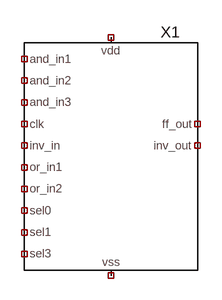
[diagram p0: schematic Test_std_cell_top.asc]
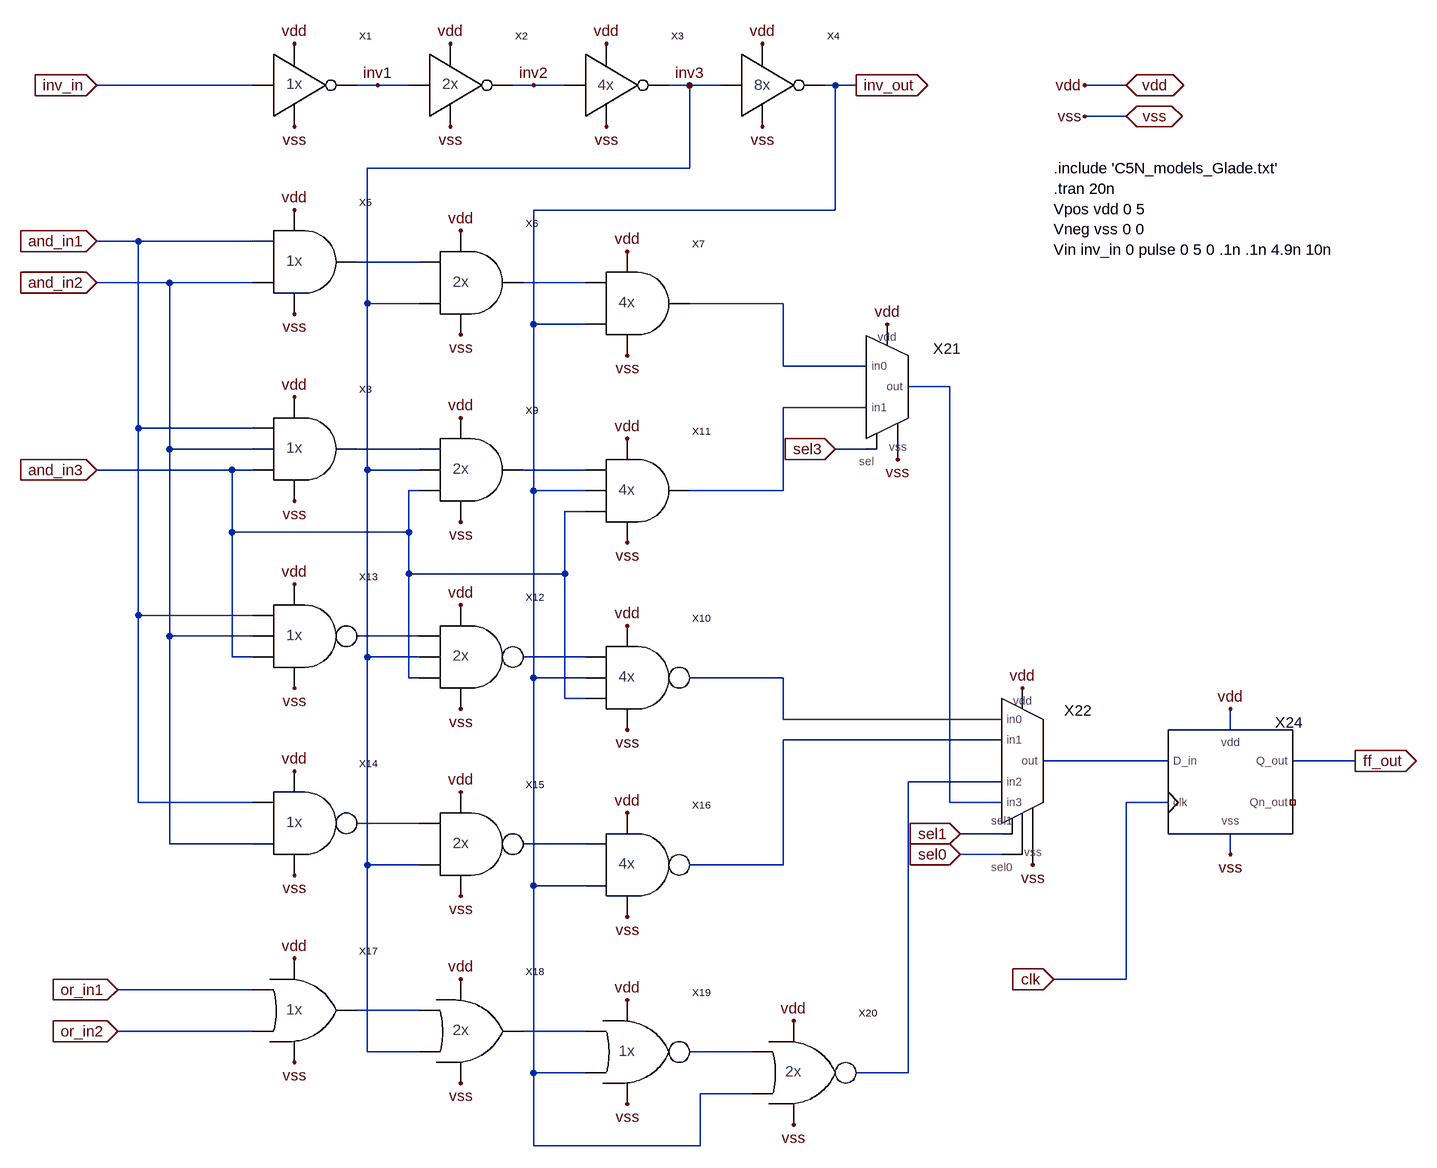
[diagram p1: sub-circuit test_std_cell.asc]
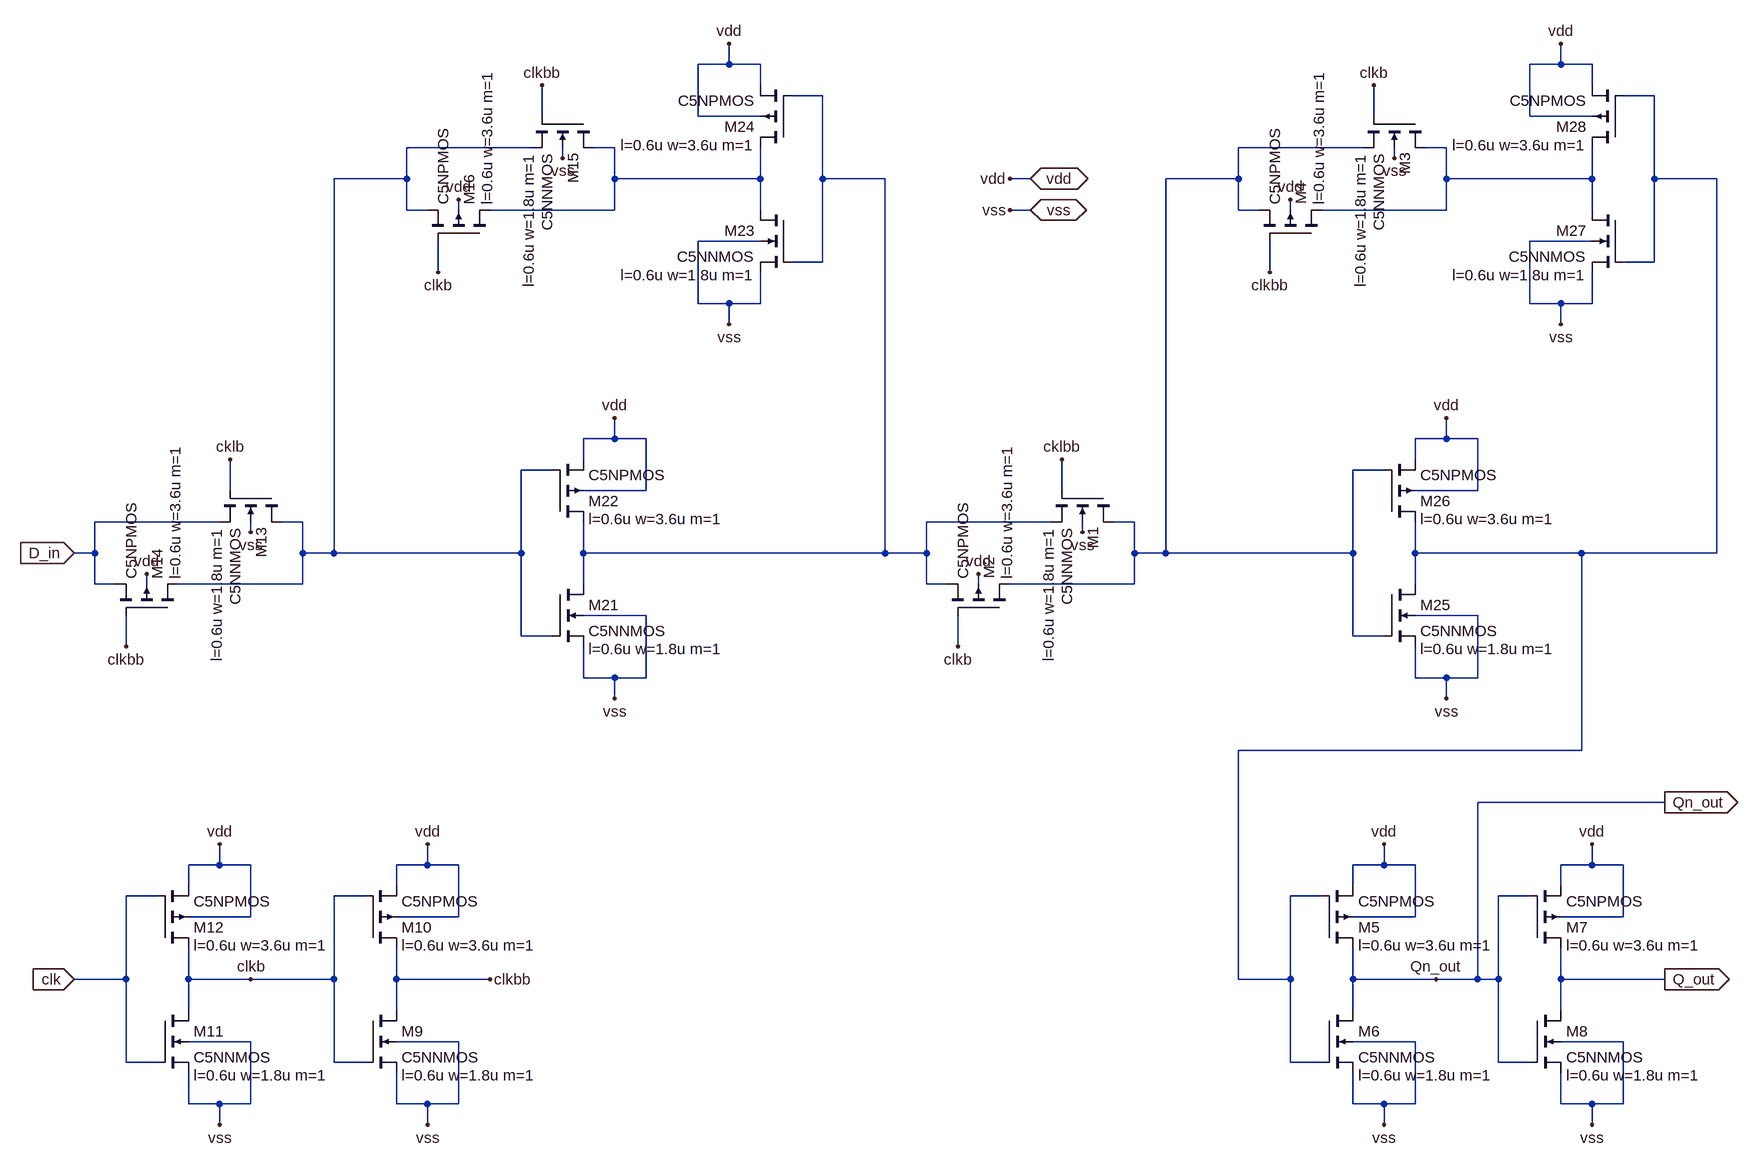
[diagram p2: sub-circuit d_flip_flop.asc]
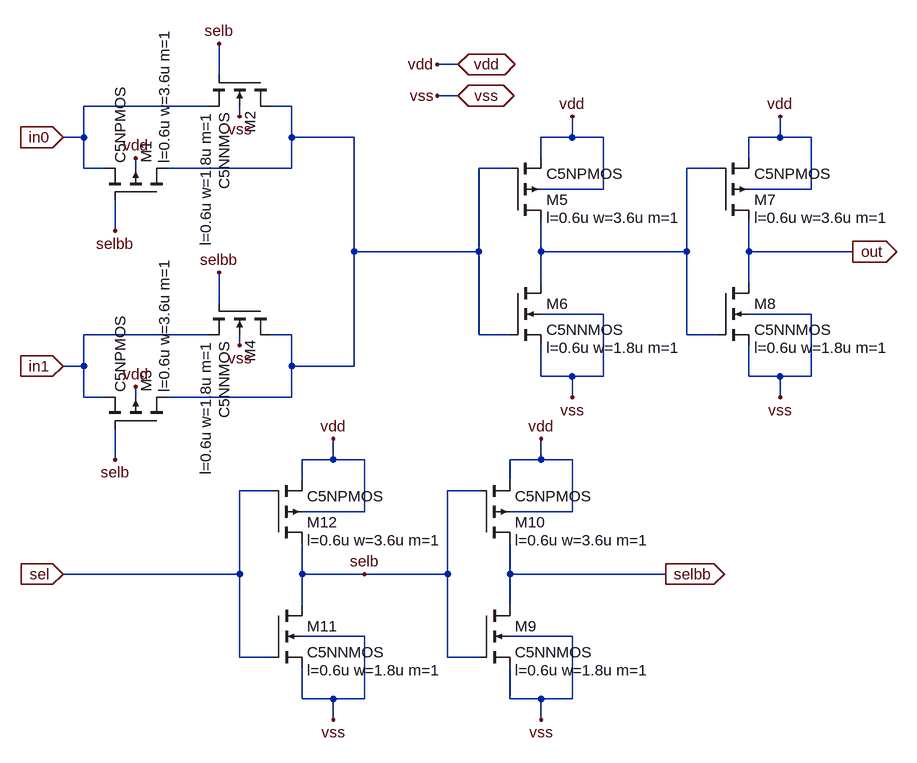
[diagram p3: sub-circuit mux2to1_1x.asc]
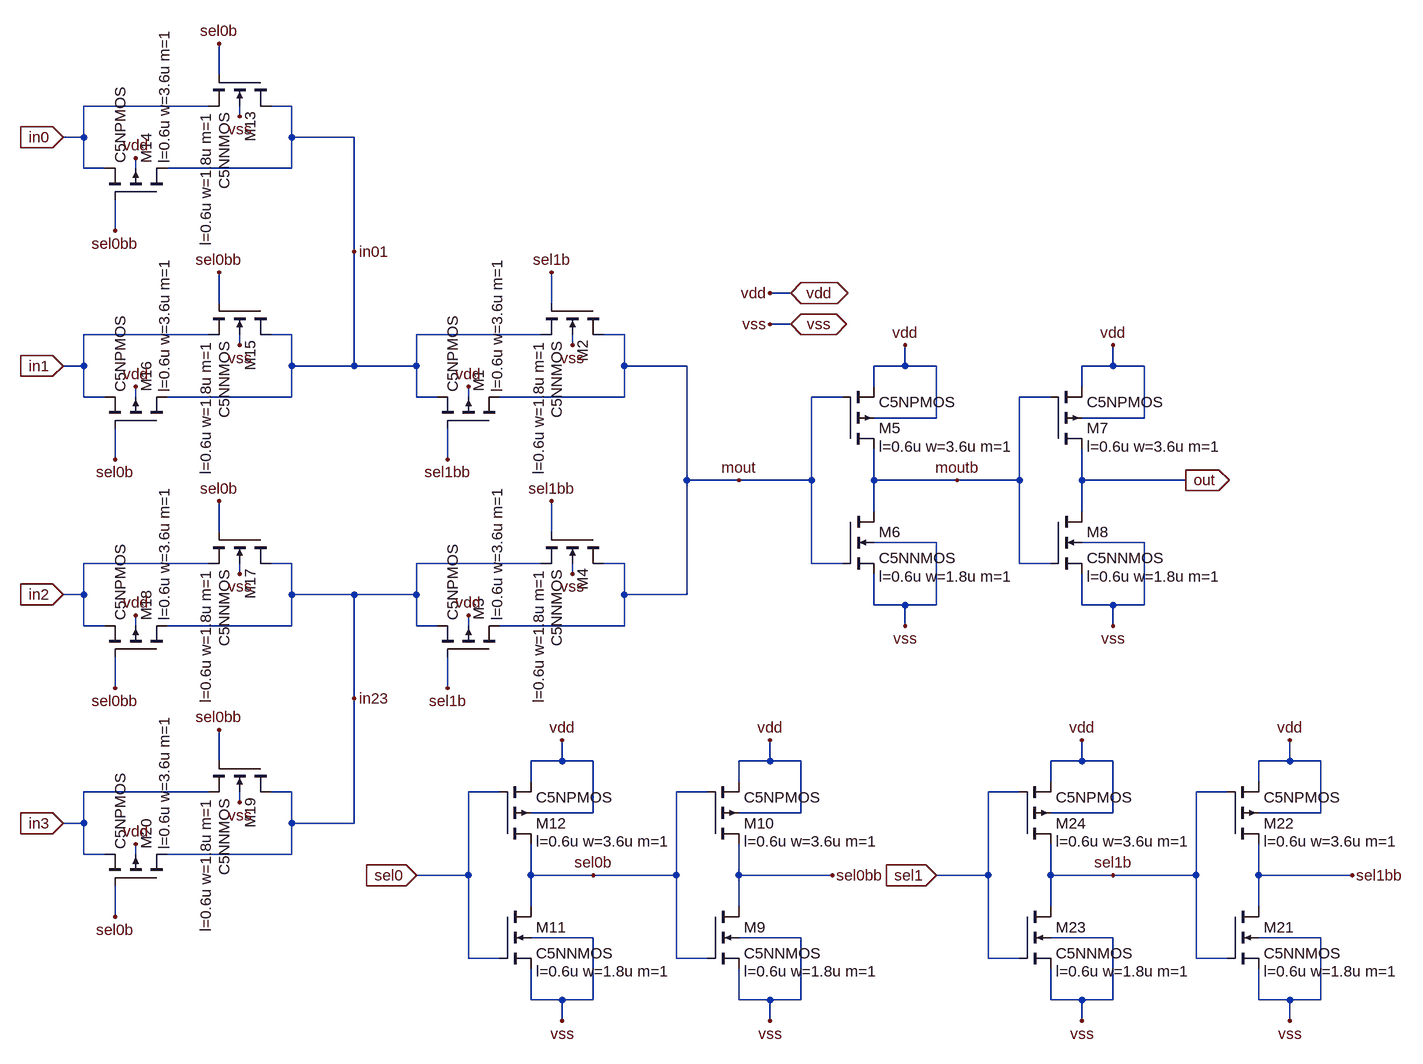
[diagram p4: sub-circuit mux4to1_1x.asc]
Test_std_cell_top.asc, the LTspice schematic file:
Version 4
SHEET 1 880 680
SYMBOL Test_std_cell 224 176 R0
SYMATTR InstName X1

test_std_cell.asc, the sub-circuit schematic file:
Version 4
SHEET 1 1372 1876
WIRE -448 192 -688 192
WIRE -256 192 -288 192
WIRE -208 192 -256 192
WIRE -16 192 -48 192
WIRE 32 192 -16 192
WIRE 224 192 192 192
WIRE 272 192 224 192
WIRE 448 192 432 192
WIRE 480 192 448 192
WIRE 896 192 832 192
WIRE 896 240 832 240
WIRE 224 320 224 192
WIRE 224 320 -272 320
WIRE 448 384 448 192
WIRE 448 384 -16 384
WIRE -624 432 -688 432
WIRE -448 432 -624 432
WIRE -192 464 -288 464
WIRE -576 496 -688 496
WIRE -448 496 -576 496
WIRE 64 496 -32 496
WIRE -272 528 -272 320
WIRE -192 528 -272 528
WIRE 368 528 224 528
WIRE -16 560 -16 384
WIRE 64 560 -16 560
WIRE 368 624 368 528
WIRE 496 624 368 624
WIRE 624 656 560 656
WIRE 496 688 368 688
WIRE -624 720 -624 432
WIRE -448 720 -624 720
WIRE -576 752 -576 496
WIRE -448 752 -576 752
WIRE -192 752 -288 752
WIRE 496 752 448 752
WIRE -480 784 -688 784
WIRE -448 784 -480 784
WIRE -272 784 -272 528
WIRE -192 784 -272 784
WIRE 64 784 -32 784
WIRE -192 816 -208 816
WIRE -16 816 -16 560
WIRE 64 816 -16 816
WIRE 368 816 368 688
WIRE 368 816 224 816
WIRE 64 848 32 848
WIRE -480 880 -480 784
WIRE -208 880 -208 816
WIRE -208 880 -480 880
WIRE -208 944 -208 880
WIRE 32 944 32 848
WIRE 32 944 -208 944
WIRE -624 1008 -624 720
WIRE -448 1008 -624 1008
WIRE -576 1040 -576 752
WIRE -448 1040 -576 1040
WIRE -192 1040 -288 1040
WIRE -480 1072 -480 880
WIRE -448 1072 -480 1072
WIRE -272 1072 -272 784
WIRE -192 1072 -272 1072
WIRE 64 1072 -32 1072
WIRE -208 1104 -208 944
WIRE -192 1104 -208 1104
WIRE -16 1104 -16 816
WIRE 64 1104 -16 1104
WIRE 368 1104 224 1104
WIRE 32 1136 32 944
WIRE 64 1136 32 1136
WIRE 368 1168 368 1104
WIRE 704 1168 368 1168
WIRE 1056 1184 1056 1152
WIRE 704 1200 368 1200
WIRE 960 1232 768 1232
WIRE 1248 1232 1152 1232
WIRE 704 1264 560 1264
WIRE -624 1296 -624 1008
WIRE -448 1296 -624 1296
WIRE 624 1296 624 656
WIRE 704 1296 624 1296
WIRE 960 1296 896 1296
WIRE -192 1328 -288 1328
WIRE 704 1344 640 1344
WIRE -576 1360 -576 1040
WIRE -448 1360 -576 1360
WIRE 64 1360 -32 1360
WIRE 704 1376 640 1376
WIRE 1056 1376 1056 1344
WIRE -272 1392 -272 1072
WIRE -192 1392 -272 1392
WIRE 368 1392 368 1200
WIRE 368 1392 224 1392
WIRE -16 1424 -16 1104
WIRE 64 1424 -16 1424
WIRE 896 1568 896 1296
WIRE 896 1568 784 1568
WIRE -448 1584 -656 1584
WIRE -192 1616 -288 1616
WIRE -448 1648 -656 1648
WIRE 64 1648 -32 1648
WIRE -272 1680 -272 1392
WIRE -192 1680 -272 1680
WIRE 320 1680 224 1680
WIRE -16 1712 -16 1424
WIRE 64 1712 -16 1712
WIRE 560 1712 560 1264
WIRE 560 1712 480 1712
WIRE 320 1744 240 1744
WIRE -16 1824 -16 1712
WIRE 240 1824 240 1744
WIRE 240 1824 -16 1824
FLAG -384 128 vdd
FLAG -144 128 vdd
FLAG 96 128 vdd
FLAG 336 128 vdd
FLAG -384 256 vss
FLAG -144 256 vss
FLAG 96 256 vss
FLAG 336 256 vss
FLAG -688 192 inv_in
IOPIN -688 192 In
FLAG 480 192 inv_out
IOPIN 480 192 Out
FLAG -256 192 inv1
FLAG -16 192 inv2
FLAG 224 192 inv3
FLAG 896 192 vdd
IOPIN 896 192 BiDir
FLAG 896 240 vss
IOPIN 896 240 BiDir
FLAG 832 192 vdd
FLAG 832 240 vss
FLAG -688 432 and_in1
IOPIN -688 432 In
FLAG -688 496 and_in2
IOPIN -688 496 In
FLAG -688 784 and_in3
IOPIN -688 784 In
FLAG -384 384 vdd
FLAG -384 544 vss
FLAG -128 416 vdd
FLAG -128 576 vss
FLAG 128 448 vdd
FLAG 128 608 vss
FLAG 128 736 vdd
FLAG 128 896 vss
FLAG 128 1024 vdd
FLAG 128 1184 vss
FLAG 128 1312 vdd
FLAG 128 1472 vss
FLAG -128 704 vdd
FLAG -128 864 vss
FLAG -128 992 vdd
FLAG -128 1152 vss
FLAG -128 1280 vdd
FLAG -128 1440 vss
FLAG -384 672 vdd
FLAG -384 832 vss
FLAG -384 960 vdd
FLAG -384 1120 vss
FLAG -384 1248 vdd
FLAG -384 1408 vss
FLAG -656 1584 or_in1
IOPIN -656 1584 In
FLAG -656 1648 or_in2
IOPIN -656 1648 In
FLAG -384 1536 vdd
FLAG -384 1696 vss
FLAG -128 1568 vdd
FLAG -128 1728 vss
FLAG 128 1600 vdd
FLAG 128 1760 vss
FLAG 384 1632 vdd
FLAG 384 1792 vss
FLAG 736 1120 vdd
FLAG 1056 1152 vdd
FLAG 1056 1376 vss
FLAG 640 1376 sel0
IOPIN 640 1376 In
FLAG 640 1344 sel1
IOPIN 640 1344 In
FLAG 784 1568 clk
IOPIN 784 1568 In
FLAG 448 752 sel3
IOPIN 448 752 In
FLAG 1248 1232 ff_out
IOPIN 1248 1232 Out
FLAG 528 560 vdd
FLAG 544 768 vss
FLAG 752 1392 vss
SYMBOL inv_1x -384 192 R0
SYMATTR InstName X1
SYMBOL inv_2x -144 192 R0
SYMATTR InstName X2
SYMBOL inv_4x 96 192 R0
SYMATTR InstName X3
SYMBOL inv_8x 336 192 R0
SYMATTR InstName X4
SYMBOL and2_1x -384 464 R0
SYMATTR InstName X5
SYMBOL and2_2x -128 496 R0
SYMATTR InstName X6
SYMBOL and2_4x 128 528 R0
SYMATTR InstName X7
SYMBOL and3_1x -384 752 R0
SYMATTR InstName X8
SYMBOL and3_2x -128 784 R0
SYMATTR InstName X9
SYMBOL nand3_4x 128 1104 R0
SYMATTR InstName X10
SYMBOL and3_4x 128 816 R0
SYMATTR InstName X11
SYMBOL nand3_2x -128 1072 R0
SYMATTR InstName X12
SYMBOL nand3_1x -384 1040 R0
SYMATTR InstName X13
SYMBOL nand2_1x -384 1328 R0
SYMATTR InstName X14
SYMBOL nand2_2x -128 1360 R0
SYMATTR InstName X15
SYMBOL nand2_4x 128 1392 R0
SYMATTR InstName X16
SYMBOL or2_1x -384 1616 R0
SYMATTR InstName X17
SYMBOL or2_2x -128 1648 R0
SYMATTR InstName X18
SYMBOL nor2_1x 128 1680 R0
SYMATTR InstName X19
SYMBOL nor2_2x 384 1712 R0
SYMATTR InstName X20
SYMBOL D_Flip_Flop 1056 1264 R0
SYMATTR InstName X24
SYMBOL mux2to1_1x 528 656 R0
SYMATTR InstName X21
SYMBOL mux4to1_1x 736 1232 R0
SYMATTR InstName X22
TEXT 784 320 Left 2 !.include 'C5N_models_Glade.txt'\n.tran 20n\nVpos vdd 0 5\nVneg vss 0 0\nVin inv_in 0 pulse 0 5 0 .1n .1n 4.9n 10n

d_flip_flop.asc, the sub-circuit schematic file:
Version 4
SHEET 1 2356 1796
WIRE 432 -816 432 -848
WIRE 432 -816 384 -816
WIRE 480 -816 432 -816
WIRE 1712 -816 1712 -848
WIRE 1712 -816 1664 -816
WIRE 1760 -816 1712 -816
WIRE 480 -784 480 -816
WIRE 1760 -784 1760 -816
WIRE 576 -768 528 -768
WIRE 1856 -768 1808 -768
WIRE 144 -736 144 -784
WIRE 384 -736 384 -816
WIRE 480 -736 384 -736
WIRE 1424 -736 1424 -784
WIRE 1664 -736 1664 -816
WIRE 1760 -736 1664 -736
WIRE 128 -688 -64 -688
WIRE 256 -688 224 -688
WIRE 1408 -688 1216 -688
WIRE 1536 -688 1504 -688
WIRE 176 -672 176 -688
WIRE 1456 -672 1456 -688
WIRE -64 -640 -64 -688
WIRE -64 -640 -176 -640
WIRE 256 -640 256 -688
WIRE 480 -640 480 -688
WIRE 480 -640 256 -640
WIRE 576 -640 576 -768
WIRE 672 -640 576 -640
WIRE 896 -640 864 -640
WIRE 1216 -640 1216 -688
WIRE 1216 -640 1104 -640
WIRE 1536 -640 1536 -688
WIRE 1760 -640 1760 -688
WIRE 1760 -640 1536 -640
WIRE 1856 -640 1856 -768
WIRE 1952 -640 1856 -640
WIRE -64 -592 -64 -640
WIRE -32 -592 -64 -592
WIRE 16 -592 16 -608
WIRE 256 -592 256 -640
WIRE 256 -592 64 -592
WIRE 480 -592 480 -640
WIRE 896 -592 864 -592
WIRE 1216 -592 1216 -640
WIRE 1248 -592 1216 -592
WIRE 1296 -592 1296 -608
WIRE 1536 -592 1536 -640
WIRE 1536 -592 1344 -592
WIRE 1760 -592 1760 -640
WIRE 480 -544 384 -544
WIRE 1760 -544 1664 -544
WIRE 576 -512 576 -640
WIRE 576 -512 528 -512
WIRE 1856 -512 1856 -640
WIRE 1856 -512 1808 -512
WIRE -16 -496 -16 -544
WIRE 1264 -496 1264 -544
WIRE 384 -448 384 -544
WIRE 432 -448 384 -448
WIRE 480 -448 480 -496
WIRE 480 -448 432 -448
WIRE 1664 -448 1664 -544
WIRE 1712 -448 1664 -448
WIRE 1760 -448 1760 -496
WIRE 1760 -448 1712 -448
WIRE 432 -416 432 -448
WIRE 1712 -416 1712 -448
WIRE 256 -240 256 -272
WIRE 256 -240 208 -240
WIRE 304 -240 256 -240
WIRE 1536 -240 1536 -272
WIRE 1536 -240 1488 -240
WIRE 1584 -240 1536 -240
WIRE 208 -208 208 -240
WIRE 1488 -208 1488 -240
WIRE 160 -192 112 -192
WIRE 1440 -192 1392 -192
WIRE -336 -160 -336 -208
WIRE 304 -160 304 -240
WIRE 304 -160 208 -160
WIRE 944 -160 944 -208
WIRE 1584 -160 1584 -240
WIRE 1584 -160 1488 -160
WIRE -352 -112 -544 -112
WIRE -224 -112 -256 -112
WIRE 928 -112 736 -112
WIRE 1056 -112 1024 -112
WIRE -304 -96 -304 -112
WIRE 976 -96 976 -112
WIRE -544 -64 -544 -112
WIRE -544 -64 -576 -64
WIRE -224 -64 -224 -112
WIRE -176 -64 -176 -640
WIRE -176 -64 -224 -64
WIRE 112 -64 112 -192
WIRE 112 -64 -176 -64
WIRE 208 -64 208 -112
WIRE 672 -64 672 -640
WIRE 672 -64 208 -64
WIRE 736 -64 736 -112
WIRE 736 -64 672 -64
WIRE 1056 -64 1056 -112
WIRE 1104 -64 1104 -640
WIRE 1104 -64 1056 -64
WIRE 1392 -64 1392 -192
WIRE 1392 -64 1104 -64
WIRE 1488 -64 1488 -112
WIRE 1744 -64 1488 -64
WIRE 1952 -64 1952 -640
WIRE 1952 -64 1744 -64
WIRE -544 -16 -544 -64
WIRE -512 -16 -544 -16
WIRE -464 -16 -464 -32
WIRE -224 -16 -224 -64
WIRE -224 -16 -416 -16
WIRE 208 -16 208 -64
WIRE 736 -16 736 -64
WIRE 768 -16 736 -16
WIRE 816 -16 816 -32
WIRE 1056 -16 1056 -64
WIRE 1056 -16 864 -16
WIRE 1488 -16 1488 -64
WIRE 304 32 208 32
WIRE 1584 32 1488 32
WIRE 112 64 112 -64
WIRE 160 64 112 64
WIRE 1392 64 1392 -64
WIRE 1440 64 1392 64
WIRE -496 80 -496 32
WIRE 784 80 784 32
WIRE 208 128 208 80
WIRE 256 128 208 128
WIRE 304 128 304 32
WIRE 304 128 256 128
WIRE 1488 128 1488 80
WIRE 1536 128 1488 128
WIRE 1584 128 1584 32
WIRE 1584 128 1536 128
WIRE 256 160 256 128
WIRE 1536 160 1536 128
WIRE 1744 240 1744 -64
WIRE 1744 240 1216 240
WIRE 1872 320 1584 320
WIRE -352 416 -352 384
WIRE -352 416 -400 416
WIRE -304 416 -352 416
WIRE -32 416 -32 384
WIRE -32 416 -80 416
WIRE 16 416 -32 416
WIRE 1440 416 1440 384
WIRE 1440 416 1392 416
WIRE 1488 416 1440 416
WIRE 1760 416 1760 384
WIRE 1760 416 1712 416
WIRE 1808 416 1760 416
WIRE -400 448 -400 416
WIRE -80 448 -80 416
WIRE 1392 448 1392 416
WIRE 1712 448 1712 416
WIRE -448 464 -496 464
WIRE -128 464 -176 464
WIRE 1344 464 1296 464
WIRE 1664 464 1616 464
WIRE -304 496 -304 416
WIRE -304 496 -400 496
WIRE 16 496 16 416
WIRE 16 496 -80 496
WIRE 1488 496 1488 416
WIRE 1488 496 1392 496
WIRE 1808 496 1808 416
WIRE 1808 496 1712 496
WIRE -496 592 -496 464
WIRE -496 592 -576 592
WIRE -400 592 -400 544
WIRE -304 592 -400 592
WIRE -176 592 -176 464
WIRE -176 592 -304 592
WIRE -80 592 -80 544
WIRE 64 592 -80 592
WIRE 1216 592 1216 240
WIRE 1296 592 1296 464
WIRE 1296 592 1216 592
WIRE 1392 592 1392 544
WIRE 1520 592 1392 592
WIRE 1584 592 1584 320
WIRE 1584 592 1520 592
WIRE 1616 592 1616 464
WIRE 1616 592 1584 592
WIRE 1712 592 1712 544
WIRE 1872 592 1712 592
WIRE -400 640 -400 592
WIRE -80 640 -80 592
WIRE 1392 640 1392 592
WIRE 1712 640 1712 592
WIRE -304 688 -400 688
WIRE 16 688 -80 688
WIRE 1488 688 1392 688
WIRE 1808 688 1712 688
WIRE -496 720 -496 592
WIRE -448 720 -496 720
WIRE -176 720 -176 592
WIRE -128 720 -176 720
WIRE 1296 720 1296 592
WIRE 1344 720 1296 720
WIRE 1616 720 1616 592
WIRE 1664 720 1616 720
WIRE -400 784 -400 736
WIRE -352 784 -400 784
WIRE -304 784 -304 688
WIRE -304 784 -352 784
WIRE -80 784 -80 736
WIRE -32 784 -80 784
WIRE 16 784 16 688
WIRE 16 784 -32 784
WIRE 1392 784 1392 736
WIRE 1440 784 1392 784
WIRE 1488 784 1488 688
WIRE 1488 784 1440 784
WIRE 1712 784 1712 736
WIRE 1760 784 1712 784
WIRE 1808 784 1808 688
WIRE 1808 784 1760 784
WIRE -352 816 -352 784
WIRE -32 816 -32 784
WIRE 1440 816 1440 784
WIRE 1760 816 1760 784
FLAG 1872 592 Q_out
IOPIN 1872 592 Out
FLAG 896 -592 vss
IOPIN 896 -592 BiDir
FLAG 896 -640 vdd
IOPIN 896 -640 BiDir
FLAG 1440 384 vdd
FLAG 1760 384 vdd
FLAG 1440 816 vss
FLAG 1760 816 vss
FLAG 864 -640 vdd
FLAG 864 -592 vss
FLAG -352 384 vdd
FLAG -32 384 vdd
FLAG -352 816 vss
FLAG -32 816 vss
FLAG -576 592 clk
IOPIN -576 592 In
FLAG -304 592 clkb
FLAG 64 592 clkbb
FLAG -336 -208 cklb
FLAG -496 80 clkbb
FLAG -16 -496 clkb
FLAG 144 -784 clkbb
FLAG -304 -96 vss
FLAG -464 -32 vdd
FLAG 16 -608 vdd
FLAG 176 -672 vss
FLAG 432 -848 vdd
FLAG 256 -272 vdd
FLAG 432 -416 vss
FLAG 256 160 vss
FLAG 1520 592 Qn_out
FLAG 1872 320 Qn_out
IOPIN 1872 320 Out
FLAG -576 -64 D_in
IOPIN -576 -64 In
FLAG 944 -208 cklbb
FLAG 784 80 clkb
FLAG 1264 -496 clkbb
FLAG 1424 -784 clkb
FLAG 976 -96 vss
FLAG 816 -32 vdd
FLAG 1296 -608 vdd
FLAG 1456 -672 vss
FLAG 1712 -848 vdd
FLAG 1536 -272 vdd
FLAG 1712 -416 vss
FLAG 1536 160 vss
SYMBOL nmos4 1664 640 R0
WINDOW 123 56 100 Left 2
SYMATTR Value2 l=0.6u w=1.8u m=1
SYMATTR InstName M8
SYMATTR Value C5NNMOS
SYMBOL pmos4 1664 544 M180
WINDOW 123 56 4 Left 2
SYMATTR Value2 l=0.6u w=3.6u m=1
SYMATTR InstName M7
SYMATTR Value C5NPMOS
SYMBOL nmos4 1344 640 R0
WINDOW 123 56 100 Left 2
SYMATTR Value2 l=0.6u w=1.8u m=1
SYMATTR InstName M6
SYMATTR Value C5NNMOS
SYMBOL pmos4 1344 544 M180
WINDOW 123 56 4 Left 2
SYMATTR Value2 l=0.6u w=3.6u m=1
SYMATTR InstName M5
SYMATTR Value C5NPMOS
SYMBOL nmos4 -128 640 R0
WINDOW 123 56 100 Left 2
SYMATTR Value2 l=0.6u w=1.8u m=1
SYMATTR InstName M9
SYMATTR Value C5NNMOS
SYMBOL pmos4 -128 544 M180
WINDOW 123 56 4 Left 2
SYMATTR Value2 l=0.6u w=3.6u m=1
SYMATTR InstName M10
SYMATTR Value C5NPMOS
SYMBOL nmos4 -448 640 R0
WINDOW 123 56 100 Left 2
SYMATTR Value2 l=0.6u w=1.8u m=1
SYMATTR InstName M11
SYMATTR Value C5NNMOS
SYMBOL pmos4 -448 544 M180
WINDOW 123 56 4 Left 2
SYMATTR Value2 l=0.6u w=3.6u m=1
SYMATTR InstName M12
SYMATTR Value C5NPMOS
SYMBOL nmos4 -256 -160 R90
WINDOW 123 56 100 Left 2
SYMATTR Value2 l=0.6u w=1.8u m=1
SYMATTR InstName M13
SYMATTR Value C5NNMOS
SYMBOL pmos4 -416 32 M270
WINDOW 123 56 4 Left 2
SYMATTR Value2 l=0.6u w=3.6u m=1
SYMATTR InstName M14
SYMATTR Value C5NPMOS
SYMBOL nmos4 224 -736 R90
WINDOW 123 56 100 Left 2
SYMATTR Value2 l=0.6u w=1.8u m=1
SYMATTR InstName M15
SYMATTR Value C5NNMOS
SYMBOL pmos4 64 -544 M270
WINDOW 123 56 4 Left 2
SYMATTR Value2 l=0.6u w=3.6u m=1
SYMATTR InstName M16
SYMATTR Value C5NPMOS
SYMBOL nmos4 160 -16 R0
WINDOW 123 56 100 Left 2
SYMATTR Value2 l=0.6u w=1.8u m=1
SYMATTR InstName M21
SYMATTR Value C5NNMOS
SYMBOL pmos4 160 -112 M180
WINDOW 123 56 4 Left 2
SYMATTR Value2 l=0.6u w=3.6u m=1
SYMATTR InstName M22
SYMATTR Value C5NPMOS
SYMBOL nmos4 528 -592 M0
WINDOW 123 56 100 Left 2
SYMATTR Value2 l=0.6u w=1.8u m=1
SYMATTR InstName M23
SYMATTR Value C5NNMOS
SYMBOL pmos4 528 -688 R180
WINDOW 123 56 4 Left 2
SYMATTR Value2 l=0.6u w=3.6u m=1
SYMATTR InstName M24
SYMATTR Value C5NPMOS
SYMBOL nmos4 1024 -160 R90
WINDOW 123 56 100 Left 2
SYMATTR Value2 l=0.6u w=1.8u m=1
SYMATTR InstName M1
SYMATTR Value C5NNMOS
SYMBOL pmos4 864 32 M270
WINDOW 123 56 4 Left 2
SYMATTR Value2 l=0.6u w=3.6u m=1
SYMATTR InstName M2
SYMATTR Value C5NPMOS
SYMBOL nmos4 1504 -736 R90
WINDOW 123 56 100 Left 2
SYMATTR Value2 l=0.6u w=1.8u m=1
SYMATTR InstName M3
SYMATTR Value C5NNMOS
SYMBOL pmos4 1344 -544 M270
WINDOW 123 56 4 Left 2
SYMATTR Value2 l=0.6u w=3.6u m=1
SYMATTR InstName M4
SYMATTR Value C5NPMOS
SYMBOL nmos4 1440 -16 R0
WINDOW 123 56 100 Left 2
SYMATTR Value2 l=0.6u w=1.8u m=1
SYMATTR InstName M25
SYMATTR Value C5NNMOS
SYMBOL pmos4 1440 -112 M180
WINDOW 123 56 4 Left 2
SYMATTR Value2 l=0.6u w=3.6u m=1
SYMATTR InstName M26
SYMATTR Value C5NPMOS
SYMBOL nmos4 1808 -592 M0
WINDOW 123 56 100 Left 2
SYMATTR Value2 l=0.6u w=1.8u m=1
SYMATTR InstName M27
SYMATTR Value C5NNMOS
SYMBOL pmos4 1808 -688 R180
WINDOW 123 56 4 Left 2
SYMATTR Value2 l=0.6u w=3.6u m=1
SYMATTR InstName M28
SYMATTR Value C5NPMOS

mux2to1_1x.asc, the sub-circuit schematic file:
Version 4
SHEET 1 1232 964
WIRE 528 -128 496 -128
WIRE 160 -112 160 -160
WIRE 528 -80 496 -80
WIRE 144 -64 -48 -64
WIRE 272 -64 240 -64
WIRE 192 -48 192 -64
WIRE -48 -16 -48 -64
WIRE -48 -16 -80 -16
WIRE 272 -16 272 -64
WIRE 368 -16 272 -16
WIRE 704 -16 704 -48
WIRE 704 -16 656 -16
WIRE 752 -16 704 -16
WIRE 1024 -16 1024 -48
WIRE 1024 -16 976 -16
WIRE 1072 -16 1024 -16
WIRE 656 16 656 -16
WIRE 976 16 976 -16
WIRE -48 32 -48 -16
WIRE -16 32 -48 32
WIRE 32 32 32 16
WIRE 272 32 272 -16
WIRE 272 32 80 32
WIRE 608 32 560 32
WIRE 928 32 880 32
WIRE 752 64 752 -16
WIRE 752 64 656 64
WIRE 1072 64 1072 -16
WIRE 1072 64 976 64
WIRE 0 128 0 80
WIRE 368 160 368 -16
WIRE 560 160 560 32
WIRE 560 160 368 160
WIRE 656 160 656 112
WIRE 880 160 880 32
WIRE 880 160 656 160
WIRE 976 160 976 112
WIRE 1136 160 976 160
WIRE 656 208 656 160
WIRE 976 208 976 160
WIRE 160 240 160 192
WIRE 752 256 656 256
WIRE 1072 256 976 256
WIRE 144 288 -48 288
WIRE 272 288 240 288
WIRE 560 288 560 160
WIRE 608 288 560 288
WIRE 880 288 880 160
WIRE 928 288 880 288
WIRE 192 304 192 288
WIRE -48 336 -48 288
WIRE -48 336 -80 336
WIRE 272 336 272 288
WIRE 368 336 368 160
WIRE 368 336 272 336
WIRE 656 352 656 304
WIRE 704 352 656 352
WIRE 752 352 752 256
WIRE 752 352 704 352
WIRE 976 352 976 304
WIRE 1024 352 976 352
WIRE 1072 352 1072 256
WIRE 1072 352 1024 352
WIRE -48 384 -48 336
WIRE -16 384 -48 384
WIRE 32 384 32 368
WIRE 272 384 272 336
WIRE 272 384 80 384
WIRE 704 384 704 352
WIRE 1024 384 1024 352
WIRE 0 480 0 432
WIRE 336 480 336 448
WIRE 336 480 288 480
WIRE 384 480 336 480
WIRE 656 480 656 448
WIRE 656 480 608 480
WIRE 704 480 656 480
WIRE 288 512 288 480
WIRE 608 512 608 480
WIRE 240 528 192 528
WIRE 560 528 512 528
WIRE 384 560 384 480
WIRE 384 560 288 560
WIRE 704 560 704 480
WIRE 704 560 608 560
WIRE 192 656 192 528
WIRE 192 656 -80 656
WIRE 288 656 288 608
WIRE 384 656 288 656
WIRE 512 656 512 528
WIRE 512 656 384 656
WIRE 608 656 608 608
WIRE 848 656 608 656
WIRE 288 704 288 656
WIRE 608 704 608 656
WIRE 384 752 288 752
WIRE 704 752 608 752
WIRE 192 784 192 656
WIRE 240 784 192 784
WIRE 512 784 512 656
WIRE 560 784 512 784
WIRE 288 848 288 800
WIRE 336 848 288 848
WIRE 384 848 384 752
WIRE 384 848 336 848
WIRE 608 848 608 800
WIRE 656 848 608 848
WIRE 704 848 704 752
WIRE 704 848 656 848
WIRE 336 880 336 848
WIRE 656 880 656 848
FLAG -80 -16 in0
IOPIN -80 -16 In
FLAG 1136 160 out
IOPIN 1136 160 Out
FLAG 528 -80 vss
IOPIN 528 -80 BiDir
FLAG 528 -128 vdd
IOPIN 528 -128 BiDir
FLAG -80 336 in1
IOPIN -80 336 In
FLAG 160 -160 selb
FLAG 0 128 selbb
FLAG 0 480 selb
FLAG 160 192 selbb
FLAG 704 -48 vdd
FLAG 1024 -48 vdd
FLAG 704 384 vss
FLAG 1024 384 vss
FLAG 192 -48 vss
FLAG 32 16 vdd
FLAG 32 368 vdd
FLAG 192 304 vss
FLAG 496 -128 vdd
FLAG 496 -80 vss
FLAG 336 448 vdd
FLAG 656 448 vdd
FLAG 336 880 vss
FLAG 656 880 vss
FLAG -80 656 sel
IOPIN -80 656 In
FLAG 384 656 selb
FLAG 848 656 selbb
IOPIN 848 656 Out
SYMBOL nmos4 928 208 R0
WINDOW 123 56 100 Left 2
SYMATTR Value2 l=0.6u w=1.8u m=1
SYMATTR InstName M8
SYMATTR Value C5NNMOS
SYMBOL pmos4 928 112 M180
WINDOW 123 56 4 Left 2
SYMATTR Value2 l=0.6u w=3.6u m=1
SYMATTR InstName M7
SYMATTR Value C5NPMOS
SYMBOL nmos4 608 208 R0
WINDOW 123 56 100 Left 2
SYMATTR Value2 l=0.6u w=1.8u m=1
SYMATTR InstName M6
SYMATTR Value C5NNMOS
SYMBOL pmos4 608 112 M180
WINDOW 123 56 4 Left 2
SYMATTR Value2 l=0.6u w=3.6u m=1
SYMATTR InstName M5
SYMATTR Value C5NPMOS
SYMBOL nmos4 240 -112 R90
WINDOW 123 56 100 Left 2
SYMATTR Value2 l=0.6u w=1.8u m=1
SYMATTR InstName M2
SYMATTR Value C5NNMOS
SYMBOL pmos4 80 80 M270
WINDOW 123 56 4 Left 2
SYMATTR Value2 l=0.6u w=3.6u m=1
SYMATTR InstName M1
SYMATTR Value C5NPMOS
SYMBOL nmos4 240 240 R90
WINDOW 123 56 100 Left 2
SYMATTR Value2 l=0.6u w=1.8u m=1
SYMATTR InstName M4
SYMATTR Value C5NNMOS
SYMBOL pmos4 80 432 M270
WINDOW 123 56 4 Left 2
SYMATTR Value2 l=0.6u w=3.6u m=1
SYMATTR InstName M3
SYMATTR Value C5NPMOS
SYMBOL nmos4 560 704 R0
WINDOW 123 56 100 Left 2
SYMATTR Value2 l=0.6u w=1.8u m=1
SYMATTR InstName M9
SYMATTR Value C5NNMOS
SYMBOL pmos4 560 608 M180
WINDOW 123 56 4 Left 2
SYMATTR Value2 l=0.6u w=3.6u m=1
SYMATTR InstName M10
SYMATTR Value C5NPMOS
SYMBOL nmos4 240 704 R0
WINDOW 123 56 100 Left 2
SYMATTR Value2 l=0.6u w=1.8u m=1
SYMATTR InstName M11
SYMATTR Value C5NNMOS
SYMBOL pmos4 240 608 M180
WINDOW 123 56 4 Left 2
SYMATTR Value2 l=0.6u w=3.6u m=1
SYMATTR InstName M12
SYMATTR Value C5NPMOS

mux4to1_1x.asc, the sub-circuit schematic file:
Version 4
SHEET 1 1484 1076
WIRE -352 -464 -352 -512
WIRE -368 -416 -560 -416
WIRE -240 -416 -272 -416
WIRE -320 -400 -320 -416
WIRE -560 -368 -560 -416
WIRE -560 -368 -592 -368
WIRE -240 -368 -240 -416
WIRE -144 -368 -240 -368
WIRE -560 -320 -560 -368
WIRE -528 -320 -560 -320
WIRE -480 -320 -480 -336
WIRE -240 -320 -240 -368
WIRE -240 -320 -432 -320
WIRE -512 -224 -512 -272
WIRE -144 -192 -144 -368
WIRE 528 -128 496 -128
WIRE -352 -112 -352 -160
WIRE 160 -112 160 -160
WIRE 528 -80 496 -80
WIRE -368 -64 -560 -64
WIRE -240 -64 -272 -64
WIRE 144 -64 -48 -64
WIRE 272 -64 240 -64
WIRE -320 -48 -320 -64
WIRE 192 -48 192 -64
WIRE -560 -16 -560 -64
WIRE -560 -16 -592 -16
WIRE -240 -16 -240 -64
WIRE -144 -16 -144 -192
WIRE -144 -16 -240 -16
WIRE -48 -16 -48 -64
WIRE -48 -16 -144 -16
WIRE 272 -16 272 -64
WIRE 368 -16 272 -16
WIRE 704 -16 704 -48
WIRE 704 -16 656 -16
WIRE 752 -16 704 -16
WIRE 1024 -16 1024 -48
WIRE 1024 -16 976 -16
WIRE 1072 -16 1024 -16
WIRE 656 16 656 -16
WIRE 976 16 976 -16
WIRE -560 32 -560 -16
WIRE -528 32 -560 32
WIRE -480 32 -480 16
WIRE -240 32 -240 -16
WIRE -240 32 -432 32
WIRE -48 32 -48 -16
WIRE -16 32 -48 32
WIRE 32 32 32 16
WIRE 272 32 272 -16
WIRE 272 32 80 32
WIRE 608 32 560 32
WIRE 928 32 880 32
WIRE 752 64 752 -16
WIRE 752 64 656 64
WIRE 1072 64 1072 -16
WIRE 1072 64 976 64
WIRE -512 128 -512 80
WIRE 0 128 0 80
WIRE 368 160 368 -16
WIRE 448 160 368 160
WIRE 560 160 560 32
WIRE 560 160 448 160
WIRE 656 160 656 112
WIRE 784 160 656 160
WIRE 880 160 880 32
WIRE 880 160 784 160
WIRE 976 160 976 112
WIRE 1136 160 976 160
WIRE 656 208 656 160
WIRE 976 208 976 160
WIRE -352 240 -352 192
WIRE 160 240 160 192
WIRE 752 256 656 256
WIRE 1072 256 976 256
WIRE -368 288 -560 288
WIRE -240 288 -272 288
WIRE 144 288 -48 288
WIRE 272 288 240 288
WIRE 560 288 560 160
WIRE 608 288 560 288
WIRE 880 288 880 160
WIRE 928 288 880 288
WIRE -320 304 -320 288
WIRE 192 304 192 288
WIRE -560 336 -560 288
WIRE -560 336 -592 336
WIRE -240 336 -240 288
WIRE -144 336 -240 336
WIRE -48 336 -48 288
WIRE -48 336 -144 336
WIRE 272 336 272 288
WIRE 368 336 368 160
WIRE 368 336 272 336
WIRE 656 352 656 304
WIRE 704 352 656 352
WIRE 752 352 752 256
WIRE 752 352 704 352
WIRE 976 352 976 304
WIRE 1024 352 976 352
WIRE 1072 352 1072 256
WIRE 1072 352 1024 352
WIRE -560 384 -560 336
WIRE -528 384 -560 384
WIRE -480 384 -480 368
WIRE -240 384 -240 336
WIRE -240 384 -432 384
WIRE -48 384 -48 336
WIRE -16 384 -48 384
WIRE 32 384 32 368
WIRE 272 384 272 336
WIRE 272 384 80 384
WIRE 704 384 704 352
WIRE 1024 384 1024 352
WIRE -512 480 -512 432
WIRE 0 480 0 432
WIRE -144 496 -144 336
WIRE -352 592 -352 544
WIRE 176 592 176 560
WIRE 176 592 128 592
WIRE 224 592 176 592
WIRE 496 592 496 560
WIRE 496 592 448 592
WIRE 544 592 496 592
WIRE 976 592 976 560
WIRE 976 592 928 592
WIRE 1024 592 976 592
WIRE 1296 592 1296 560
WIRE 1296 592 1248 592
WIRE 1344 592 1296 592
WIRE 128 624 128 592
WIRE 448 624 448 592
WIRE 928 624 928 592
WIRE 1248 624 1248 592
WIRE -368 640 -560 640
WIRE -240 640 -272 640
WIRE 80 640 32 640
WIRE 400 640 352 640
WIRE 880 640 832 640
WIRE 1200 640 1152 640
WIRE -320 656 -320 640
WIRE 224 672 224 592
WIRE 224 672 128 672
WIRE 544 672 544 592
WIRE 544 672 448 672
WIRE 1024 672 1024 592
WIRE 1024 672 928 672
WIRE 1344 672 1344 592
WIRE 1344 672 1248 672
WIRE -560 688 -560 640
WIRE -560 688 -592 688
WIRE -240 688 -240 640
WIRE -144 688 -144 496
WIRE -144 688 -240 688
WIRE -560 736 -560 688
WIRE -528 736 -560 736
WIRE -480 736 -480 720
WIRE -240 736 -240 688
WIRE -240 736 -432 736
WIRE 32 768 32 640
WIRE 32 768 -48 768
WIRE 128 768 128 720
WIRE 224 768 128 768
WIRE 352 768 352 640
WIRE 352 768 224 768
WIRE 448 768 448 720
WIRE 592 768 448 768
WIRE 832 768 832 640
WIRE 832 768 752 768
WIRE 928 768 928 720
WIRE 1024 768 928 768
WIRE 1152 768 1152 640
WIRE 1152 768 1024 768
WIRE 1248 768 1248 720
WIRE 1392 768 1248 768
WIRE 128 816 128 768
WIRE 448 816 448 768
WIRE 928 816 928 768
WIRE 1248 816 1248 768
WIRE -512 832 -512 784
WIRE 224 864 128 864
WIRE 544 864 448 864
WIRE 1024 864 928 864
WIRE 1344 864 1248 864
WIRE 32 896 32 768
WIRE 80 896 32 896
WIRE 352 896 352 768
WIRE 400 896 352 896
WIRE 832 896 832 768
WIRE 880 896 832 896
WIRE 1152 896 1152 768
WIRE 1200 896 1152 896
WIRE 128 960 128 912
WIRE 176 960 128 960
WIRE 224 960 224 864
WIRE 224 960 176 960
WIRE 448 960 448 912
WIRE 496 960 448 960
WIRE 544 960 544 864
WIRE 544 960 496 960
WIRE 928 960 928 912
WIRE 976 960 928 960
WIRE 1024 960 1024 864
WIRE 1024 960 976 960
WIRE 1248 960 1248 912
WIRE 1296 960 1248 960
WIRE 1344 960 1344 864
WIRE 1344 960 1296 960
WIRE 176 992 176 960
WIRE 496 992 496 960
WIRE 976 992 976 960
WIRE 1296 992 1296 960
FLAG 1136 160 out
IOPIN 1136 160 Out
FLAG 528 -80 vss
IOPIN 528 -80 BiDir
FLAG 528 -128 vdd
IOPIN 528 -128 BiDir
FLAG 160 -160 sel1b
FLAG 0 128 sel1bb
FLAG 0 480 sel1b
FLAG 160 192 sel1bb
FLAG 704 -48 vdd
FLAG 1024 -48 vdd
FLAG 704 384 vss
FLAG 1024 384 vss
FLAG 192 -48 vss
FLAG 32 16 vdd
FLAG 32 368 vdd
FLAG 192 304 vss
FLAG 496 -128 vdd
FLAG 496 -80 vss
FLAG 176 560 vdd
FLAG 496 560 vdd
FLAG 176 992 vss
FLAG 496 992 vss
FLAG -48 768 sel0
IOPIN -48 768 In
FLAG 224 768 sel0b
FLAG 592 768 sel0bb
FLAG -592 -368 in0
IOPIN -592 -368 In
FLAG -592 -16 in1
IOPIN -592 -16 In
FLAG -352 -512 sel0b
FLAG -512 -224 sel0bb
FLAG -512 128 sel0b
FLAG -352 -160 sel0bb
FLAG -320 -400 vss
FLAG -480 -336 vdd
FLAG -480 16 vdd
FLAG -320 -48 vss
FLAG -592 336 in2
IOPIN -592 336 In
FLAG -592 688 in3
IOPIN -592 688 In
FLAG -352 192 sel0b
FLAG -512 480 sel0bb
FLAG -512 832 sel0b
FLAG -352 544 sel0bb
FLAG -320 304 vss
FLAG -480 368 vdd
FLAG -480 720 vdd
FLAG -320 656 vss
FLAG 976 560 vdd
FLAG 1296 560 vdd
FLAG 976 992 vss
FLAG 1296 992 vss
FLAG 752 768 sel1
IOPIN 752 768 In
FLAG 1024 768 sel1b
FLAG 1392 768 sel1bb
FLAG -144 496 in23
FLAG -144 -192 in01
FLAG 448 160 mout
FLAG 784 160 moutb
SYMBOL nmos4 928 208 R0
WINDOW 123 56 100 Left 2
SYMATTR Value2 l=0.6u w=1.8u m=1
SYMATTR InstName M8
SYMATTR Value C5NNMOS
SYMBOL pmos4 928 112 M180
WINDOW 123 56 4 Left 2
SYMATTR Value2 l=0.6u w=3.6u m=1
SYMATTR InstName M7
SYMATTR Value C5NPMOS
SYMBOL nmos4 608 208 R0
WINDOW 123 56 100 Left 2
SYMATTR Value2 l=0.6u w=1.8u m=1
SYMATTR InstName M6
SYMATTR Value C5NNMOS
SYMBOL pmos4 608 112 M180
WINDOW 123 56 4 Left 2
SYMATTR Value2 l=0.6u w=3.6u m=1
SYMATTR InstName M5
SYMATTR Value C5NPMOS
SYMBOL nmos4 240 -112 R90
WINDOW 123 56 100 Left 2
SYMATTR Value2 l=0.6u w=1.8u m=1
SYMATTR InstName M2
SYMATTR Value C5NNMOS
SYMBOL pmos4 80 80 M270
WINDOW 123 56 4 Left 2
SYMATTR Value2 l=0.6u w=3.6u m=1
SYMATTR InstName M1
SYMATTR Value C5NPMOS
SYMBOL nmos4 240 240 R90
WINDOW 123 56 100 Left 2
SYMATTR Value2 l=0.6u w=1.8u m=1
SYMATTR InstName M4
SYMATTR Value C5NNMOS
SYMBOL pmos4 80 432 M270
WINDOW 123 56 4 Left 2
SYMATTR Value2 l=0.6u w=3.6u m=1
SYMATTR InstName M3
SYMATTR Value C5NPMOS
SYMBOL nmos4 400 816 R0
WINDOW 123 56 100 Left 2
SYMATTR Value2 l=0.6u w=1.8u m=1
SYMATTR InstName M9
SYMATTR Value C5NNMOS
SYMBOL pmos4 400 720 M180
WINDOW 123 56 4 Left 2
SYMATTR Value2 l=0.6u w=3.6u m=1
SYMATTR InstName M10
SYMATTR Value C5NPMOS
SYMBOL nmos4 80 816 R0
WINDOW 123 56 100 Left 2
SYMATTR Value2 l=0.6u w=1.8u m=1
SYMATTR InstName M11
SYMATTR Value C5NNMOS
SYMBOL pmos4 80 720 M180
WINDOW 123 56 4 Left 2
SYMATTR Value2 l=0.6u w=3.6u m=1
SYMATTR InstName M12
SYMATTR Value C5NPMOS
SYMBOL nmos4 -272 -464 R90
WINDOW 123 56 100 Left 2
SYMATTR Value2 l=0.6u w=1.8u m=1
SYMATTR InstName M13
SYMATTR Value C5NNMOS
SYMBOL pmos4 -432 -272 M270
WINDOW 123 56 4 Left 2
SYMATTR Value2 l=0.6u w=3.6u m=1
SYMATTR InstName M14
SYMATTR Value C5NPMOS
SYMBOL nmos4 -272 -112 R90
WINDOW 123 56 100 Left 2
SYMATTR Value2 l=0.6u w=1.8u m=1
SYMATTR InstName M15
SYMATTR Value C5NNMOS
SYMBOL pmos4 -432 80 M270
WINDOW 123 56 4 Left 2
SYMATTR Value2 l=0.6u w=3.6u m=1
SYMATTR InstName M16
SYMATTR Value C5NPMOS
SYMBOL nmos4 -272 240 R90
WINDOW 123 56 100 Left 2
SYMATTR Value2 l=0.6u w=1.8u m=1
SYMATTR InstName M17
SYMATTR Value C5NNMOS
SYMBOL pmos4 -432 432 M270
WINDOW 123 56 4 Left 2
SYMATTR Value2 l=0.6u w=3.6u m=1
SYMATTR InstName M18
SYMATTR Value C5NPMOS
SYMBOL nmos4 -272 592 R90
WINDOW 123 56 100 Left 2
SYMATTR Value2 l=0.6u w=1.8u m=1
SYMATTR InstName M19
SYMATTR Value C5NNMOS
SYMBOL pmos4 -432 784 M270
WINDOW 123 56 4 Left 2
SYMATTR Value2 l=0.6u w=3.6u m=1
SYMATTR InstName M20
SYMATTR Value C5NPMOS
SYMBOL nmos4 1200 816 R0
WINDOW 123 56 100 Left 2
SYMATTR Value2 l=0.6u w=1.8u m=1
SYMATTR InstName M21
SYMATTR Value C5NNMOS
SYMBOL pmos4 1200 720 M180
WINDOW 123 56 4 Left 2
SYMATTR Value2 l=0.6u w=3.6u m=1
SYMATTR InstName M22
SYMATTR Value C5NPMOS
SYMBOL nmos4 880 816 R0
WINDOW 123 56 100 Left 2
SYMATTR Value2 l=0.6u w=1.8u m=1
SYMATTR InstName M23
SYMATTR Value C5NNMOS
SYMBOL pmos4 880 720 M180
WINDOW 123 56 4 Left 2
SYMATTR Value2 l=0.6u w=3.6u m=1
SYMATTR InstName M24
SYMATTR Value C5NPMOS

The netlist it stands for:
* Test_std_cell_top.asc
XX1 NC_01 NC_02 NC_03 NC_04 NC_05 NC_06 NC_07 NC_08 NC_09 NC_10 NC_11 NC_12 NC_13 NC_14 test_std_cell

* block symbol definitions
.subckt test_std_cell and_in1 and_in2 and_in3 clk inv_in or_in1 or_in2 sel0 sel1 sel3 ff_out inv_out vdd vss
XX1 inv_in inv1 vdd vss inv_1x  ; pins A Z vdd vss
XX2 inv1 inv2 vdd vss inv_2x  ; pins A Z vdd vss
XX3 inv2 inv3 vdd vss inv_4x  ; pins A Z vdd vss
XX4 inv3 inv_out vdd vss inv_8x  ; pins A Z vdd vss
XX5 and_in1 and_in2 N001 vdd vss and2_1x  ; pins A B Y vdd vss
XX6 N001 inv3 N002 vdd vss and2_2x  ; pins A B Y vdd vss
XX7 N002 inv_out N003 vdd vss and2_4x  ; pins A B Y vdd vss
XX8 and_in1 and_in2 and_in3 N006 vdd vss and3_1x  ; pins A B C Y vdd vss
XX9 N006 inv3 and_in3 N007 vdd vss and3_2x  ; pins A B C Y vdd vss
XX10 N009 inv_out and_in3 N010 vdd vss nand3_4x  ; pins A B C Y vdd vss
XX11 N007 inv_out and_in3 N005 vdd vss and3_4x  ; pins A B C Y vdd vss
XX12 N008 inv3 and_in3 N009 vdd vss nand3_2x  ; pins A B C Y vdd vss
XX13 and_in1 and_in2 and_in3 N008 vdd vss nand3_1x  ; pins A B C Y vdd vss
XX14 and_in1 and_in2 N014 vdd vss nand2_1x  ; pins A B Y vdd vss
XX15 N014 inv3 N015 vdd vss nand2_2x  ; pins A B Y vdd vss
XX16 N015 inv_out N011 vdd vss nand2_4x  ; pins A B Y vdd vss
XX17 or_in1 or_in2 N016 vdd vss or2_1x  ; pins A B Y vdd vss
XX18 N016 inv3 N017 vdd vss or2_2x  ; pins A B Y vdd vss
XX19 N017 inv_out N018 vdd vss nor2_1x  ; pins A B Y vdd vss
XX20 N018 inv_out N013 vdd vss nor2_2x  ; pins A B Y vdd vss
XX24 N012 clk ff_out NC_01 vdd vss d_flip_flop
XX21 N003 N005 sel3 N004 vdd vss mux2to1_1x
XX22 N010 N011 N013 N004 sel1 sel0 N012 vdd vss mux4to1_1x
.include 'C5N_models_Glade.txt'
.tran 20n
Vpos vdd 0 5
Vneg vss 0 0
Vin inv_in 0 pulse 0 5 0 .1n .1n 4.9n 10n
.ends test_std_cell

.subckt d_flip_flop D_in clk Q_out Qn_out vdd vss
M8 Q_out Qn_out vss vss C5NNMOS l=0.6u w=1.8u m=1
M7 Q_out Qn_out vdd vdd C5NPMOS l=0.6u w=3.6u m=1
M6 Qn_out N002 vss vss C5NNMOS l=0.6u w=1.8u m=1
M5 Qn_out N002 vdd vdd C5NPMOS l=0.6u w=3.6u m=1
M9 clkbb clkb vss vss C5NNMOS l=0.6u w=1.8u m=1
M10 clkbb clkb vdd vdd C5NPMOS l=0.6u w=3.6u m=1
M11 clkb clk vss vss C5NNMOS l=0.6u w=1.8u m=1
M12 clkb clk vdd vdd C5NPMOS l=0.6u w=3.6u m=1
M13 N003 cklb D_in vss C5NNMOS l=0.6u w=1.8u m=1
M14 N003 clkbb D_in vdd C5NPMOS l=0.6u w=3.6u m=1
M15 N004 clkbb N003 vss C5NNMOS l=0.6u w=1.8u m=1
M16 N004 clkb N003 vdd C5NPMOS l=0.6u w=3.6u m=1
M21 N001 N003 vss vss C5NNMOS l=0.6u w=1.8u m=1
M22 N001 N003 vdd vdd C5NPMOS l=0.6u w=3.6u m=1
M23 N004 N001 vss vss C5NNMOS l=0.6u w=1.8u m=1
M24 N004 N001 vdd vdd C5NPMOS l=0.6u w=3.6u m=1
M1 N005 cklbb N001 vss C5NNMOS l=0.6u w=1.8u m=1
M2 N005 clkb N001 vdd C5NPMOS l=0.6u w=3.6u m=1
M3 N006 clkb N005 vss C5NNMOS l=0.6u w=1.8u m=1
M4 N006 clkbb N005 vdd C5NPMOS l=0.6u w=3.6u m=1
M25 N002 N005 vss vss C5NNMOS l=0.6u w=1.8u m=1
M26 N002 N005 vdd vdd C5NPMOS l=0.6u w=3.6u m=1
M27 N006 N002 vss vss C5NNMOS l=0.6u w=1.8u m=1
M28 N006 N002 vdd vdd C5NPMOS l=0.6u w=3.6u m=1
.ends d_flip_flop

.subckt mux2to1_1x in0 in1 sel out vdd vss
M8 out N002 vss vss C5NNMOS l=0.6u w=1.8u m=1
M7 out N002 vdd vdd C5NPMOS l=0.6u w=3.6u m=1
M6 N002 N001 vss vss C5NNMOS l=0.6u w=1.8u m=1
M5 N002 N001 vdd vdd C5NPMOS l=0.6u w=3.6u m=1
M2 N001 selb in0 vss C5NNMOS l=0.6u w=1.8u m=1
M1 N001 selbb in0 vdd C5NPMOS l=0.6u w=3.6u m=1
M4 N001 selbb in1 vss C5NNMOS l=0.6u w=1.8u m=1
M3 N001 selb in1 vdd C5NPMOS l=0.6u w=3.6u m=1
M9 selbb selb vss vss C5NNMOS l=0.6u w=1.8u m=1
M10 selbb selb vdd vdd C5NPMOS l=0.6u w=3.6u m=1
M11 selb sel vss vss C5NNMOS l=0.6u w=1.8u m=1
M12 selb sel vdd vdd C5NPMOS l=0.6u w=3.6u m=1
.ends mux2to1_1x

.subckt mux4to1_1x in0 in1 in2 in3 sel1 sel0 out vdd vss
M8 out moutb vss vss C5NNMOS l=0.6u w=1.8u m=1
M7 out moutb vdd vdd C5NPMOS l=0.6u w=3.6u m=1
M6 moutb mout vss vss C5NNMOS l=0.6u w=1.8u m=1
M5 moutb mout vdd vdd C5NPMOS l=0.6u w=3.6u m=1
M2 mout sel1b in01 vss C5NNMOS l=0.6u w=1.8u m=1
M1 mout sel1bb in01 vdd C5NPMOS l=0.6u w=3.6u m=1
M4 mout sel1bb in23 vss C5NNMOS l=0.6u w=1.8u m=1
M3 mout sel1b in23 vdd C5NPMOS l=0.6u w=3.6u m=1
M9 sel0bb sel0b vss vss C5NNMOS l=0.6u w=1.8u m=1
M10 sel0bb sel0b vdd vdd C5NPMOS l=0.6u w=3.6u m=1
M11 sel0b sel0 vss vss C5NNMOS l=0.6u w=1.8u m=1
M12 sel0b sel0 vdd vdd C5NPMOS l=0.6u w=3.6u m=1
M13 in01 sel0b in0 vss C5NNMOS l=0.6u w=1.8u m=1
M14 in01 sel0bb in0 vdd C5NPMOS l=0.6u w=3.6u m=1
M15 in01 sel0bb in1 vss C5NNMOS l=0.6u w=1.8u m=1
M16 in01 sel0b in1 vdd C5NPMOS l=0.6u w=3.6u m=1
M17 in23 sel0b in2 vss C5NNMOS l=0.6u w=1.8u m=1
M18 in23 sel0bb in2 vdd C5NPMOS l=0.6u w=3.6u m=1
M19 in23 sel0bb in3 vss C5NNMOS l=0.6u w=1.8u m=1
M20 in23 sel0b in3 vdd C5NPMOS l=0.6u w=3.6u m=1
M21 sel1bb sel1b vss vss C5NNMOS l=0.6u w=1.8u m=1
M22 sel1bb sel1b vdd vdd C5NPMOS l=0.6u w=3.6u m=1
M23 sel1b sel1 vss vss C5NNMOS l=0.6u w=1.8u m=1
M24 sel1b sel1 vdd vdd C5NPMOS l=0.6u w=3.6u m=1
.ends mux4to1_1x

.model NMOS NMOS
.model PMOS PMOS
.lib standard.mos
.backanno
.end